# EAGLE design gate-boron (EAGLE 9.6.2)
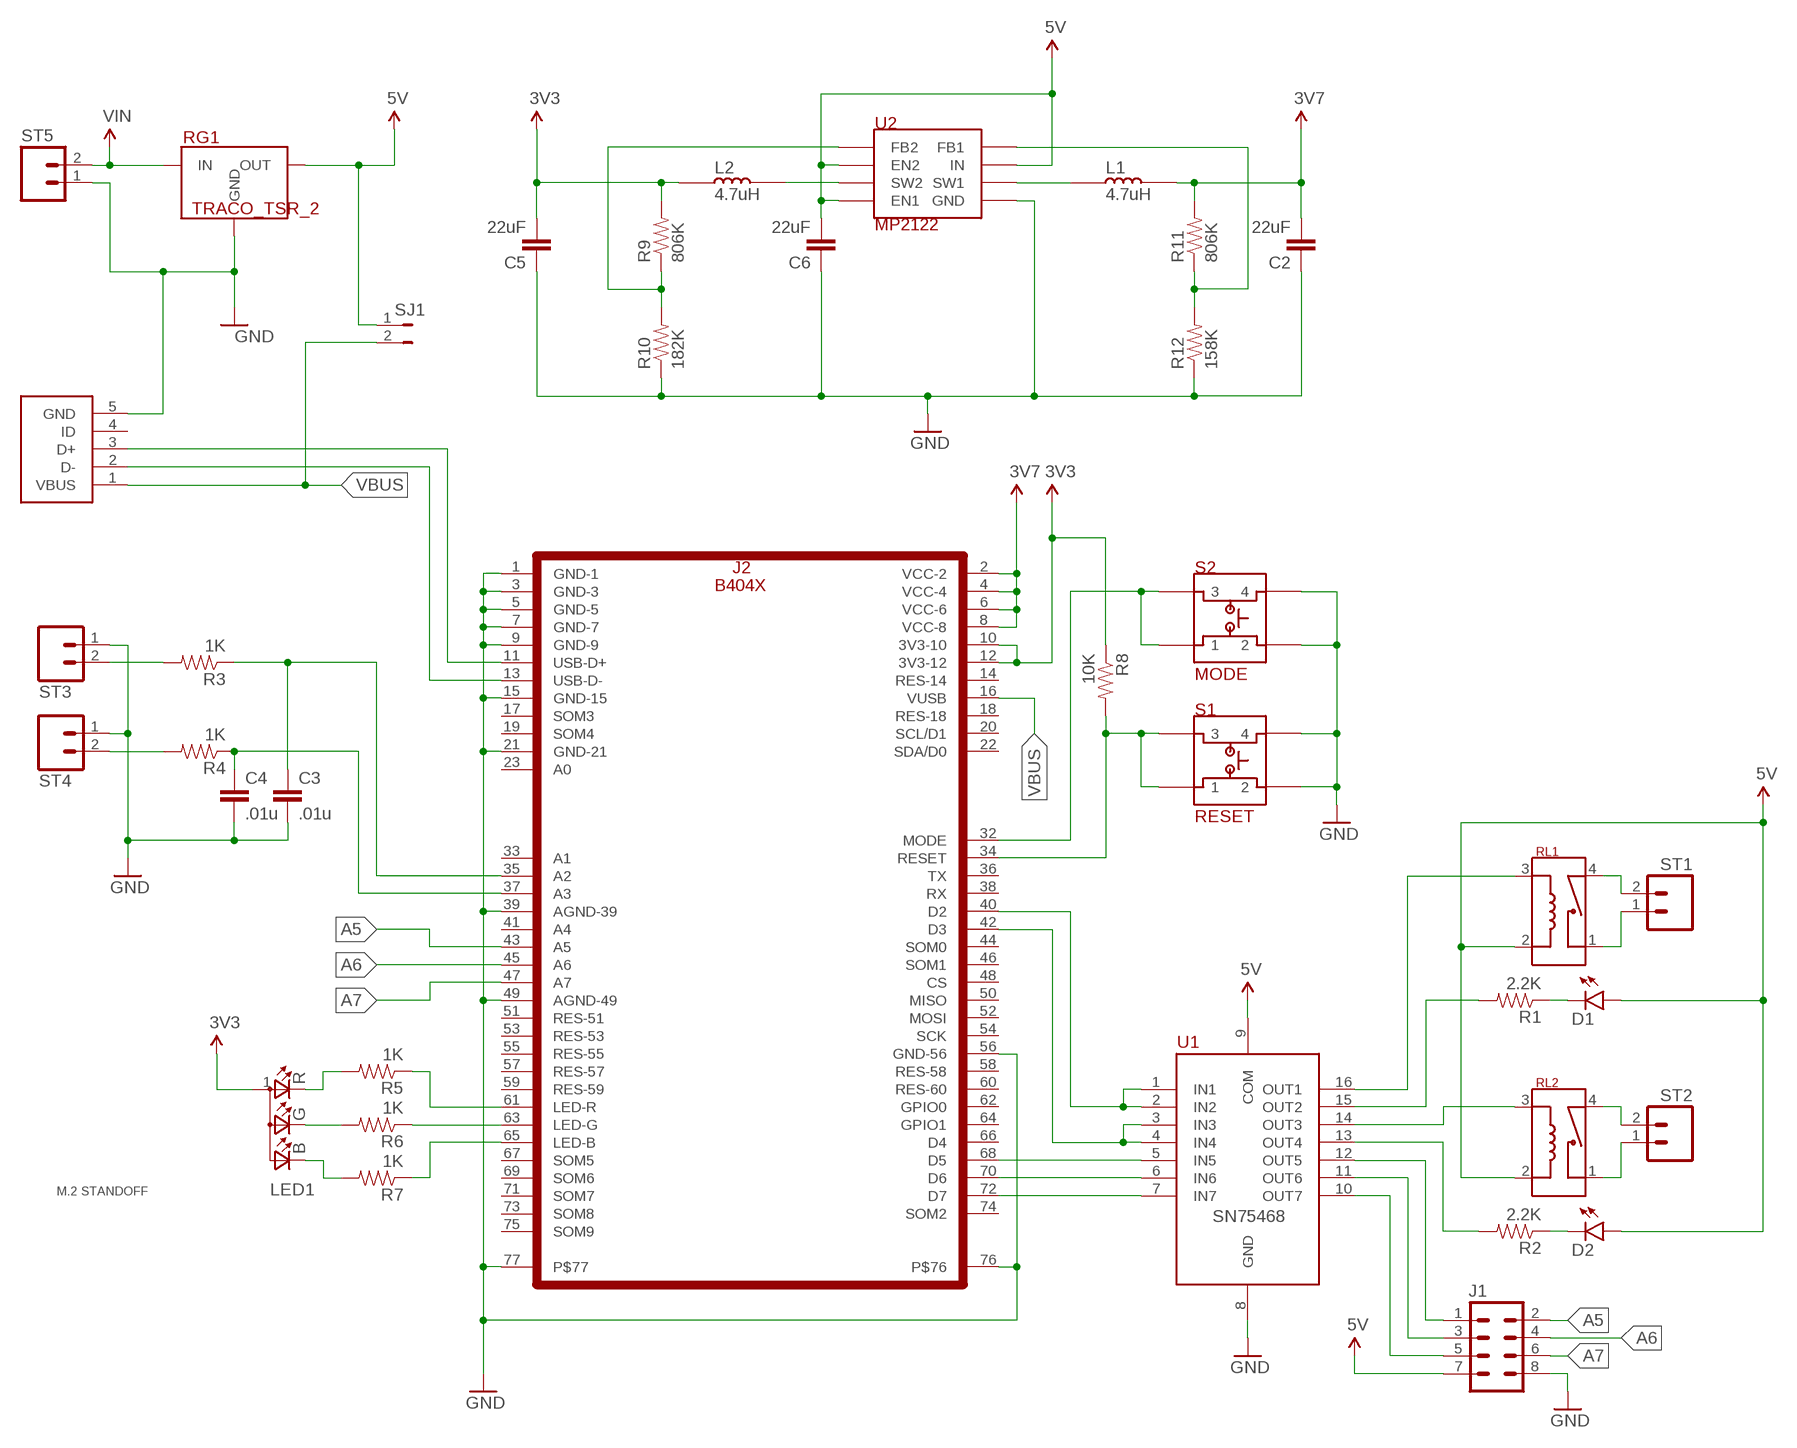
[diagram p0: schematic, sheet 1]

## Parts
C2  22uF  CAP-22UF-0805  [0805]
C3  .01u  CAP0603-CAP  [0603-CAP]
C4  .01u  CAP0603-CAP  [0603-CAP]
C5  22uF  CAP-22UF-0805  [0805]
C6  22uF  CAP-22UF-0805  [0805]
D1  LED0603  [LED-0603]
D2  LED0603  [LED-0603]
J1  M04X2  [2X4]
J2  B404X  SPARK_M.2EKEY  [SPARK_M.2EKEY-LESS-CREAM]
L1  4.7uH  INDUCTOR-4.7UH  [1008-BOURNS]
L2  4.7uH  INDUCTOR-4.7UH  [1008-BOURNS]
LED1  LED-RGB-CREE-SMD  [LED-RGB-CREE-SMD]
R1  2.2K  RESISTOR0603  [0603-RES]
R2  2.2K  RESISTOR0603  [0603-RES]
R3  1K  RESISTOR0603  [0603-RES]
R4  1K  RESISTOR0603  [0603-RES]
R5  1K  RESISTOR0603  [0603-RES]
R6  1K  RESISTOR0603  [0603-RES]
R7  1K  RESISTOR0603  [0603-RES]
R8  10K  RESISTOR0603  [0603-RES]
R9  806K  RES-806K-0603  [0603-RES]
R10  182K  RES-182K-0603  [0603-RES]
R11  806K  RES-806K-0603  [0603-RES]
R12  158K  RES-158K-0603  [0603-RES]
RG1  TRACO_TSR_2  [TRACO_TSR_2]
RL1  HE3600_RELAY  [HE3600_RELAY]
RL2  HE3600_RELAY  [HE3600_RELAY]
S1  RESET  SWITCH-MOM-4.5  [SWITCH-MOM-4.5]
S2  MODE  SWITCH-MOM-4.5  [SWITCH-MOM-4.5]
SJ1  JUMPER-PTH-2-NO  [PTH-JUMPER-2-NO_NO_SILK]
ST1  SCREWTERM_2  [SCREWTERM_0.2X2]
ST2  SCREWTERM_2  [SCREWTERM_0.2X2]
ST3  SCREWTERM_2  [SCREWTERM_0.2X2]
ST4  SCREWTERM_2  [SCREWTERM_0.2X2]
ST5  SCREWTERM_2  [SCREWTERM_0.2X2]
U1  SN75468  [SOIC16]
U2  MP2122  MPS2112  [TSOT23-8-MPS]
U$1  M2-STANDOFF  [M2-STANDOFF]
U$2  USB-MICRO-B-SOCKET-AMPHENOL  [USB-B-SMT-AMPHENOL]

## Nets
3V3: C5.2 J2.10(3V3-10) J2.12(3V3-12) L2.1 LED1.1(A) R8.1 R9.2
3V7: C2.2 J2.2(VCC-2) J2.4(VCC-4) J2.6(VCC-6) J2.8(VCC-8) L1.2 R11.2
5V: C6.2 D1.A D2.A J1.7 RG1.3(OUT) RL1.2(R1) RL2.2(R1) SJ1.1 U1.9(COM) U2.2(EN2) U2.4(EN1) U2.7(IN)
A5: J1.2 J2.43(A5)
A6: J1.4 J2.45(A6)
A7: J1.6 J2.47(A7)
GND: C2.1 C3.2 C4.2 C5.1 C6.1 J1.8 J2.1(GND-1) J2.3(GND-3) J2.5(GND-5) J2.7(GND-7) J2.9(GND-9) J2.15(GND-15) J2.21(GND-21) J2.39(AGND-39) J2.49(AGND-49) J2.56(GND-56) J2.76 J2.77 R10.1 R12.1 RG1.2(GND) S1.2 S1.4 S2.2 S2.4 ST3.1 ST4.1 ST5.1 U1.8(GND) U2.5(GND) U$2.5(GND)
L5: J1.1 U1.12(OUT5)
L6: J1.3 U1.11(OUT6)
L7: J1.5 U1.10(OUT7)
N$1: D2.C R2.1
N$2: RL1.4(C2) ST1.2
N$3: D1.C R1.1
N$4: RL2.4(C2) ST2.2
N$5: R2.2 U1.13(OUT4)
N$6: R1.2 U1.15(OUT2)
N$7: C4.1 J2.37(A3) R4.1
N$8: J2.13(USB-D-) U$2.2(D-)
N$9: RL2.1(C1) ST2.1
N$10: LED1.4(R) R5.2
N$11: LED1.3(G) R6.2
N$12: LED1.2(B) R7.2
N$13: RL1.1(C1) ST1.1
N$14: L2.2 U2.3(SW2)
N$15: J2.63(LED-G) R6.1
N$16: J2.61(LED-R) R5.1
N$17: R4.2 ST4.2
N$18: R3.2 ST3.2
N$19: J2.65(LED-B) R7.1
N$20: L1.1 U2.6(SW1)
N$21: J2.32(MODE) S2.1 S2.3
N$22: RL2.3(R2) U1.14(OUT3)
N$23: J2.34(RESET) R8.2 S1.1 S1.3
N$24: R11.1 R12.2 U2.8(FB1)
N$25: R9.1 R10.2 U2.1(FB2)
N$26: J2.40(D2) U1.1(IN1) U1.2(IN2)
N$27: J2.42(D3) U1.3(IN3) U1.4(IN4)
N$28: J2.11(USB-D+) U$2.3(D+)
N$29: J2.68(D5) U1.5(IN5)
N$30: J2.70(D6) U1.6(IN6)
N$31: C3.1 J2.35(A2) R3.1
N$32: J2.72(D7) U1.7(IN7)
N$33: RL1.3(R2) U1.16(OUT1)
VBUS: J2.16(VUSB) SJ1.2 U$2.1(VBUS)
VIN: RG1.1(IN) ST5.2
Unconnected: J2.14(RES-14) J2.17(SOM3) J2.18(RES-18) J2.19(SOM4) J2.20(SCL/D1) J2.22(SDA/D0) J2.23(A0) J2.33(A1) J2.36(TX) J2.38(RX) J2.41(A4) J2.44(SOM0) J2.46(SOM1) J2.48(CS) J2.50(MISO) J2.51(RES-51) J2.52(MOSI) J2.53(RES-53) J2.54(SCK) J2.55(RES-55) J2.57(RES-57) J2.58(RES-58) J2.59(RES-59) J2.60(RES-60) J2.62(GPIO0) J2.64(GPIO1) J2.66(D4) J2.67(SOM5) J2.69(SOM6) J2.71(SOM7) J2.73(SOM8) J2.74(SOM2) J2.75(SOM9) U$2.4(ID)

## Library data of the parts
C2 C5 C6 = SomUSB1:CAP-22UF-0805: 22 uF capacitor 6.3V 0805 $ .314 https://www.digikey.com/product-detail/en/murata-electronics-north-america/GRM219R61A226MEA0D/490-9951-1-ND/5026414
C3 C4 = SparkFun-Capacitors:CAP: Capacitor Standard 0603 ceramic capacitor, and 0.1" leaded capacitor.
D1 D2 = SparkFun-LED:LED: LEDs Standard schematic elements and footprints for 5mm, 3mm, 1206, and 0603 sized LEDs. 5mm - Spark Fun Electronics SKU : COM-00529 (and others)
J1 = SparkFun-Connectors:M04X2: .1" header, two rows of four.
J2 = SomUSB1:SPARK_M.2EKEY: $1.42 CONN FEMALE 67POS 0.020 GOLD TE Connectivity AMP Connectors 2199230-4 https://www.digikey.com/product-detail/en/te-connectivity-amp-connectors/2199230-4/A115904CT-ND/4208916
L1 L2 = SomUSB1:INDUCTOR-4.7UH: FIXED IND 4.7UH 1.1A 110 MOHM $0.26 Bourns CVH252009-4R7M 4.7µH Shielded Multilayer Inductor 1.1A 110 mOhm Max 1008 (2520 Metric) https://www.digikey.com/product-detail/en/bourns-inc/CVH252009-4R7M/CVH252009-4R7MCT-ND/3440080
LED1 = SomUSB1:LED-RGB-CREE-SMD: LED RGB DIFFUSED 4SMD $ 0.35 Cree CLMVB-FKA-CFHEHLCBB7A363 2mm 4-PLCC common anode RGB LED https://www.digikey.com/product-detail/en/cree-inc/CLMVB-FKA-CFHEHLCBB7A363/CLMVB-FKA-CFHEHLCBB7A363CT-ND/6138627 Red=68 ohm, Green/Blue=33 ohm @ 3.3V
R1-R8 = SparkFun-Resistors:RESISTOR: Resistor Basic schematic elements and footprints for 0603, 1206, and PTH resistors.
R9 R11 = SomUSB1:RES-806K-0603: Panasonic Electronic Components ERJ-3EKF8063V 806 kOhms ±1% 0.1W, 1/10W Chip Resistor 0603 (1608 Metric) Automotive AEC-Q200 Thick Film https://www.digikey.com/products/en/resistors/chip-resistor-surface-mount/52?k=&pkeyword=&sv=0&v=10&pv7=2&pv1989=0&pv2085=u806+kOhms&pv16=5&sf=1&FV=ffe00034&quantity=&ColumnSort=0&page=1&stock=1&pageSize=25
R10 = SomUSB1:RES-182K-0603: Panasonic Electronic Components ERJ-3EKF1823V 182 kOhms ±1% 0.1W, 1/10W Chip Resistor 0603 (1608 Metric) Automotive AEC-Q200 Thick Film https://www.digikey.com/product-detail/en/panasonic-electronic-components/ERJ-3EKF1823V/P182KHCT-ND/198208
R12 = SomUSB1:RES-158K-0603: Panasonic Electronic Components ERJ-3EKF1583V 158 kOhms ±1% 0.1W, 1/10W Chip Resistor 0603 (1608 Metric) Automotive AEC-Q200 Thick Film https://www.digikey.com/product-detail/en/panasonic-electronic-components/ERJ-3EKF1583V/P158KHCT-ND/198182
RG1 = Puffin:TRACO_TSR_2
RL1 RL2 = Puffin:HE3600_RELAY
S1 S2 = SomUSB1:SWITCH-MOM-4.5: Manufacturer: E-Switch Manufacturer Part Number: TL3305AF160QG Description: SWITCH TACTILE SPST-NO 50MA 12V Detailed Description: Tactile Switch SPST-NO Top Actuated Surface Mount $0.20 https://www.digikey.com/product-detail/en/e-switch/TL3305AF160QG/EG5350CT-ND/5816195
SJ1 = SomUSB1:JUMPER-PTH-2-NO
ST1-ST5 = Puffin:SCREWTERM_2
U1 = Puffin:SN75468
U2 = SomUSB1:MPS2112: Monolithic Power Systems Inc. MP2122GJ-Z $2.51 IC REG BUCK ADJ 2A DL SYNC Buck Switching Regulator IC Positive Adjustable 0.608V 2 Output 2A SOT-23-8 Thin, TSOT-23-8 https://www.digikey.com/product-detail/en/monolithic-power-systems-inc/MP2122GJ-Z/1589-1872-1-ND/5291939
U$1 = SomUSB1:M2-STANDOFF: https://www.digikey.com/product-detail/en/jae-electronics/SM3ZS067U310-NUT1-R1800/670-2864-1-ND/5955848
U$2 = SomUSB1:USB-MICRO-B-SOCKET-AMPHENOL: CONN USB MICRO B RECPT SMT R/A $0.42 Amphenol FCI 10118194-0001LF https://www.digikey.com/products/en?keywords=609-4618-1-nd

## Board
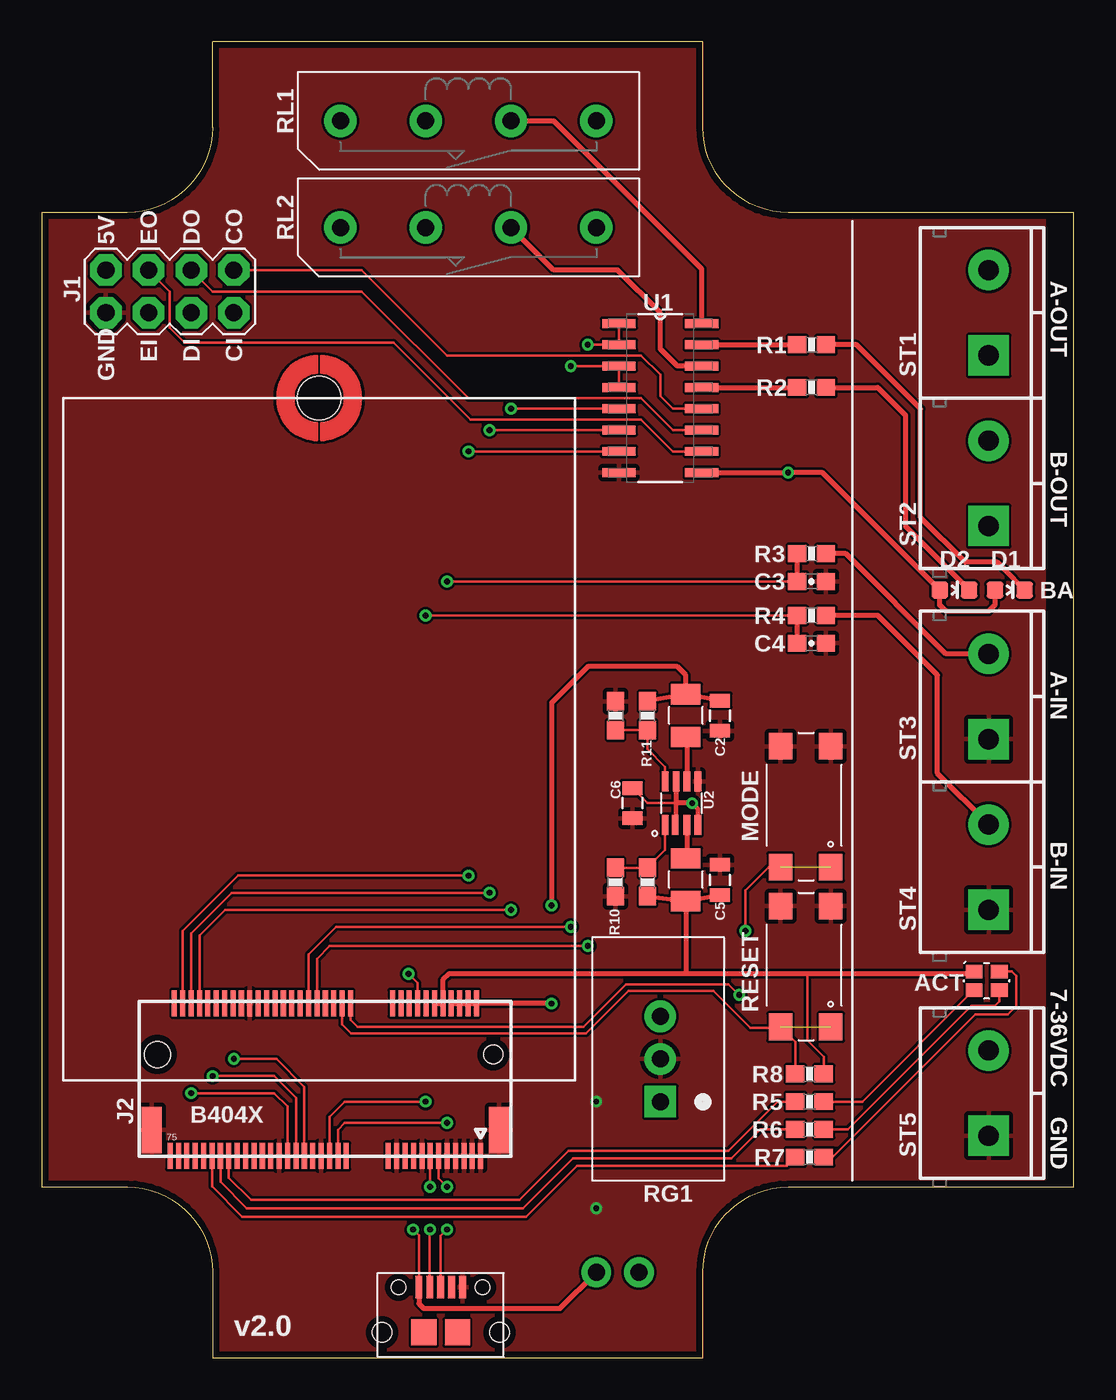
[diagram p1: board, top side]
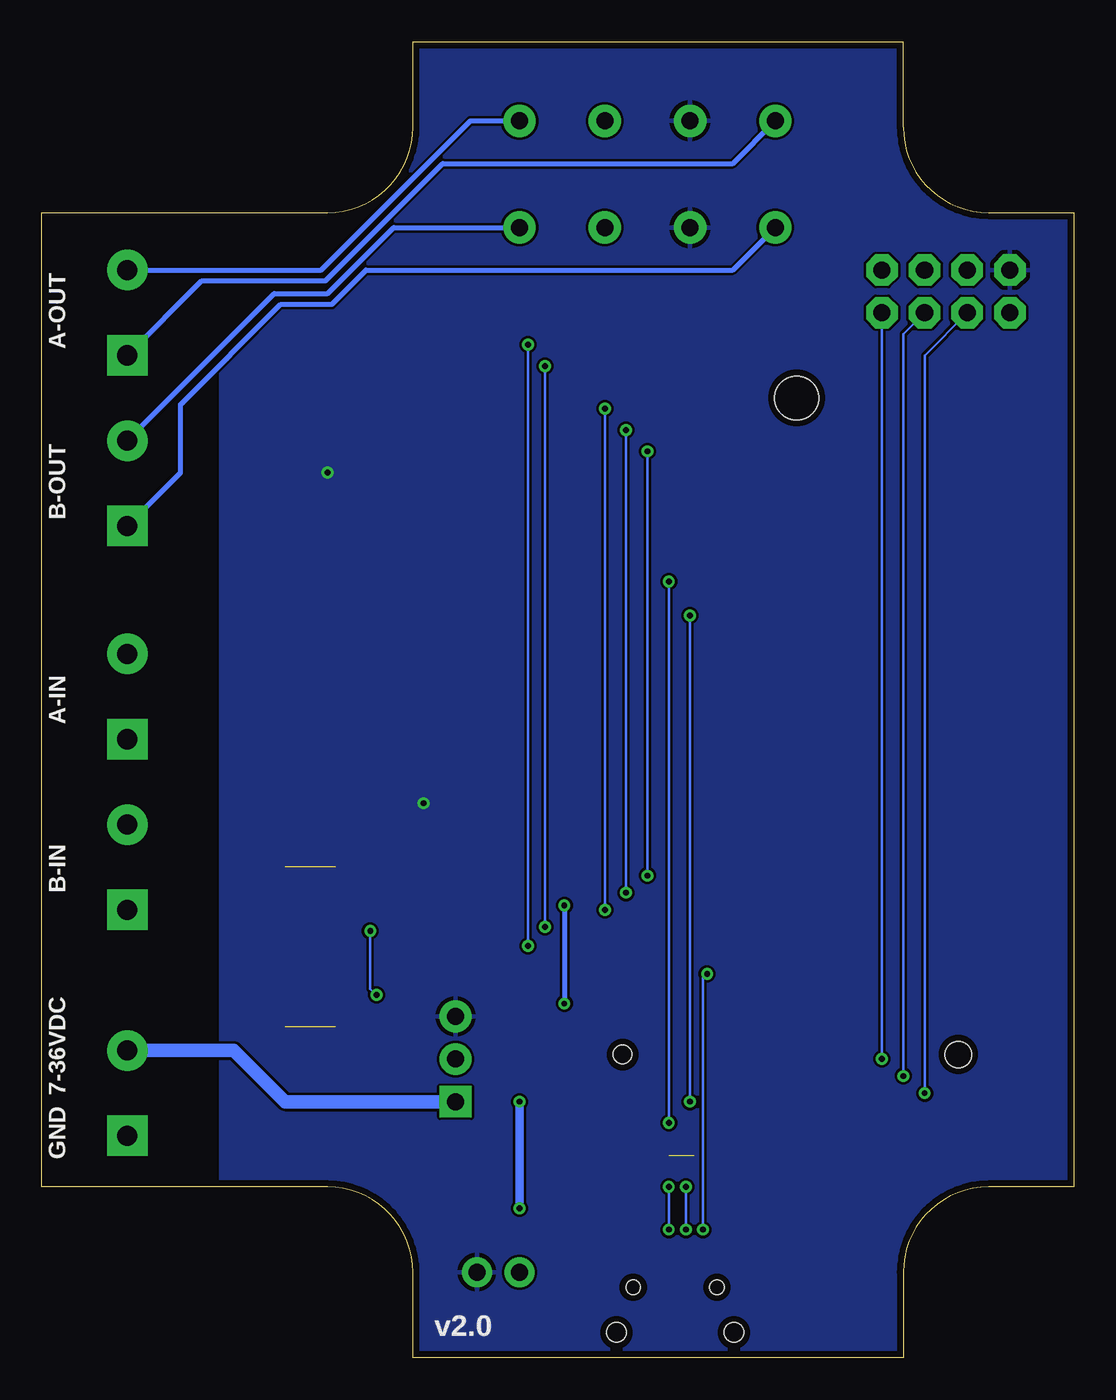
[diagram p2: board, bottom side, seen from below]

Size 61.47 x 78.36 mm. Coordinates in mm from the lower left corner, seen from the top.
Outline: 39.37,73.28 39.37,78.36 10.16,78.36 10.16,73.28 arc-90 5.08,68.2 0,68.2 0,10.16 5.08,10.16 arc-90 10.16,5.08 10.16,0 39.37,0 39.37,5.08 arc-90 44.45,10.16 61.47,10.16 61.47,68.2 44.45,68.2
Outline: 44.45,68.2 arc-90 39.37,73.28
Outline: 44.45,68.2 arc-90 39.37,73.28
Copper layers (1*16): Top 0.0356mm / dielectric 1.5011mm / Bottom 0.0356mm
Design rules "oshpark-2layer": minimum track width 6mil, minimum drill 13mil, track to track 6mil, track to pad 6mil, pad to pad 6mil, via to via 6mil, smd to smd 6mil, copper to edge 15mil, drill to drill 6mil, minimum pad ring 7mil, minimum via ring 7mil, stop-mask expansion 2.5mil, vias tented up to drill 0mil, thermal gap 10mil

### Footprints (pad centres in the part's own frame; a part is rotated, then mirrored left to right if it is on the bottom)
0805 = smd 0.8 x 1.2: 1 -0.9,0; 2 0.9,0
0603-CAP = smd 1.1 x 1: 1 -0.85,0; 2 0.85,0
LED-0603 = smd 1 x 1: A 0,-0.877; C 0,0.877
2X4 = drill 1.016 pad 1.88 octagon: 1 -3.81,-1.27; 2 -3.81,1.27; 3 -1.27,-1.27; 4 -1.27,1.27; 5 1.27,-1.27; 6 1.27,1.27; 7 3.81,-1.27; 8 3.81,1.27
SPARK_M.2EKEY-LESS-CREAM = smd 0.3 x 1.55: 1 -9.62,4.51; 2 -9.37,-4.59; 3 -9.12,4.51; 4 -8.87,-4.59; 5 -8.62,4.51; 6 -8.37,-4.59; 7 -8.12,4.51; 8 -7.87,-4.59; 9 -7.62,4.51; 10 -7.37,-4.59; 11 -7.12,4.51; 12 -6.87,-4.59; 13 -6.62,4.51; 14 -6.37,-4.59; 15 -6.12,4.51; 16 -5.87,-4.59; 17 -5.62,4.51; 18 -5.37,-4.59; 19 -5.12,4.51; 20 -4.87,-4.59; 21 -4.62,4.51; 22 -4.37,-4.59; 23 -4.12,4.51; 32 -1.87,-4.59; 33 -1.62,4.51; 34 -1.37,-4.59; 35 -1.12,4.51; 36 -0.87,-4.59; 37 -0.62,4.51; 38 -0.37,-4.59; 39 -0.12,4.51; 40 0.13,-4.59; 41 0.38,4.51; 42 0.63,-4.59; 43 0.88,4.51; 44 1.13,-4.59; 45 1.38,4.51; 46 1.63,-4.59; 47 1.88,4.51; 48 2.13,-4.59; 49 2.38,4.51; 50 2.63,-4.59; 51 2.88,4.51; 52 3.13,-4.59; 53 3.38,4.51; 54 3.63,-4.59; 55 3.88,4.51; 56 4.13,-4.59; 57 4.38,4.51; 58 4.63,-4.59; 59 4.88,4.51; 60 5.13,-4.59; 61 5.38,4.51; 62 5.63,-4.59; 63 5.88,4.51; 64 6.13,-4.59; 65 6.38,4.51; 66 6.63,-4.59; 67 6.88,4.51; 68 7.13,-4.59; 69 7.38,4.51; 70 7.63,-4.59; 71 7.88,4.51; 72 8.13,-4.59; 73 8.38,4.51; 74 8.63,-4.59; 75 8.88,4.51 | smd 1.2 x 2.75: 76 9.98,2.96; 77 -10.72,2.96 | hole 1.1: -10.37,-1.54 | hole 1.55: 9.63,-1.54
1008-BOURNS = smd 1.2 x 1.75: 1 0,0; 2 2.55,0
LED-RGB-CREE-SMD = smd 1 x 0.8: 1 1.5,0; 2 0,0; 3 0,1.1; 4 1.5,1.1
0603-RES = smd 1.1 x 1: 1 -0.85,0; 2 0.85,0
TRACO_TSR_2 = drill 1.016 pad 1.88 square: 1 -2.54,0 | drill 1.016 pad 1.88: 2 0,0; 3 2.54,0
HE3600_RELAY = drill 1.016 pad 1.93: 1 0,0; 2 0,-5.08; 3 0,-10.16; 4 0,-15.24
SWITCH-MOM-4.5 = smd 1.6 x 1.4: 1 0,0; 2 7.2,0; 3 0,3; 4 7.2,3
PTH-JUMPER-2-NO_NO_SILK = drill 1.016 pad 1.778: 1 -1.27,0; 2 1.27,0
SCREWTERM_0.2X2 = drill 1.2 pad 2.413 square: 1 0,0 | drill 1.2 pad 2.413: 2 5.08,0
SOIC16 = smd 1.981 x 0.533: 1 -2.464,4.445; 2 -2.464,3.175; 3 -2.464,1.905; 4 -2.464,0.635; 5 -2.464,-0.635; 6 -2.464,-1.905; 7 -2.464,-3.175; 8 -2.464,-4.445; 9 2.464,-4.445; 10 2.464,-3.175; 11 2.464,-1.905; 12 2.464,-0.635; 13 2.464,0.635; 14 2.464,1.905; 15 2.464,3.175; 16 2.464,4.445
TSOT23-8-MPS = smd 0.4 x 1.2: 1 -0.975,-1.3; 2 -0.375,-1.3; 3 0.325,-1.3; 4 0.975,-1.3; 5 0.975,1.3; 6 0.325,1.3; 7 -0.325,1.3; 8 -0.975,1.3
M2-STANDOFF = hole 2.6: 0,0
USB-B-SMT-AMPHENOL = smd 0.4 x 1.35: 1 -1.3,0; 2 -0.65,0; 3 0,0; 4 0.65,0; 5 1.3,0 | smd 1.5 x 1.55: P$6 -1,-2.7; P$7 1,-2.7 | hole 0.85: -2.5,0; 2.5,0 | hole 1.15: -3.5,-2.7; 3.5,-2.7

### Placement (x,y rotation side)
C2  40.39,38.23 90 top
C3  45.85,46.23 0 top
C4  45.85,42.55 0 top
C5  40.39,28.45 270 top
C6  35.18,33.02 90 top
D1  57.66,45.72 270 top
D2  54.36,45.72 270 top
J1  7.62,63.5 180 top
J2  16.51,16.51 180 top
L1  38.35,36.96 90 top
L2  38.35,27.18 90 top
LED1  57.02,22.99 180 top
R1  45.85,60.33 180 top
R2  45.85,57.78 180 top
R3  45.85,47.88 0 top
R4  45.85,44.2 0 top
R5  45.72,15.24 0 top
R6  45.72,13.59 0 top
R7  45.72,11.94 0 top
R8  45.72,16.89 180 top
R9  36.07,28.32 270 top
R10  34.16,28.32 90 top
R11  36.07,38.23 90 top
R12  34.16,38.23 270 top
RG1  36.83,17.78 90 top
RL1  17.78,73.66 90 top
RL2  17.78,67.31 90 top
S1  46.99,19.68 90 top
S2  46.99,29.21 90 top
SJ1  34.29,5.08 180 top
ST1  56.39,59.69 90 top
ST2  56.39,49.53 90 top
ST3  56.39,36.83 90 top
ST4  56.39,26.67 90 top
ST5  56.39,13.21 90 top
U1  36.83,57.15 0 top
U2  38.1,33.02 0 top
U$1  16.51,57.15 0 top
U$2  23.75,4.19 0 top

### Tracks (layer width: path | path; a pad name or v marks a point on that pad's centre or on a via)
3V3
  Top 0.152: R8.1 46.57,17.91 45.59,18.88 45.59,22.86
  Top 0.254: C5.2 L2.1 R9.2
  Top 0.305: J2.12 J2.10 23.88,22.48 24.26,22.86 38.35,22.86 | L2.1 38.35,22.86 | 38.35,22.86 45.59,22.86 55.4,22.86 LED1.1
3V7  (via drill 0.35)
  Top 0.254: C2.2 L1.2 36.19,39.12 R11.2 | J2.2 25.9,21.08
  Top 0.305: L1.2 38.35,40.64 37.85,41.15 32.51,41.15 30.35,38.99 v30.35,26.92 | v30.35,21.08 25.9,21.08 | J2.8 J2.6 J2.4 J2.2
  Bottom 0.305: v30.35,26.92 v30.35,21.08
5V  (via drill 0.35)
  Top 0.152: 37.77,31.77 U2.2 | C6.2 36.08,33.02 37.77,33.02
  Top 0.254: 37.77,33.02 37.77,31.77 | U2.4 39.08,32.68 v38.73,33.02
  Top 0.305: D1.A 56.78,44.84 56.39,44.45 53.85,44.45 53.48,44.82 D2.A 46.49,52.7 v44.45,52.7 U1.9 | U2.7 37.77,33.02 v38.73,33.02
  pour Bottom: -1.27,80.01 -1.27,-1.27 50.8,-1.27 50.8,80.01
A5  (via drill 0.35)
  Top 0.152: v11.43,17.78 13.97,17.78 15.63,16.12 J2.43
  Bottom 0.152: J1.2 v11.43,17.78
A6  (via drill 0.35)
  Top 0.152: v10.16,16.76 13.84,16.76 15.13,15.48 J2.45
  Bottom 0.152: J1.4 10.16,60.96 v10.16,16.76
A7  (via drill 0.35)
  Top 0.152: v8.89,15.75 13.84,15.75 14.63,14.96 J2.47
  Bottom 0.152: J1.6 8.89,59.69 v8.89,15.75
GND  (via drill 0.35)  (1 unrouted)
  Bottom 0.508: v33.02,15.24 v33.02,8.89
  pour Top: 0,81.28 0,-1.27 59.69,-1.27 59.69,81.28
L5
  Top 0.152: U1.12 37.59,56.52 36.83,57.28 36.83,58.55 35.69,59.69 24.13,59.69 19.05,64.77 J1.1
L6
  Top 0.152: J1.3 10.16,63.5 19.05,63.5 25.4,57.15 35.69,57.15 37.59,55.24 U1.11
L7
  Top 0.152: U1.10 37.59,53.98 35.69,55.88 25.53,55.88 20.95,60.45 8.51,60.45 7.62,61.34 7.62,63.5 J1.5
N$1
  Top 0.305: R2.1 49.78,57.78 51.44,56.13 51.44,49.52 D2.C
N$2
  Bottom 0.305: ST1.2 44.83,64.77 35.94,73.66 RL1.4
N$3
  Top 0.305: D1.C 57.29,46.99 56.91,47.37 54.99,47.37 52.32,50.04 52.32,56.52 48.51,60.33 R1.1
N$4
  Bottom 0.305: ST2.2 47.62,63.37 44.45,63.37 40.51,67.31 RL2.4
N$5
  Top 0.305: U1.13 R2.2
N$6
  Top 0.305: U1.15 R1.2
N$7  (via drill 0.35)
  Top 0.152: R4.1 v22.86,44.2 | v22.86,15.24 18.03,15.24 17.13,14.34 J2.37
  Top 0.305: C4.1 R4.1
  Bottom 0.152: v22.86,44.2 v22.86,15.24
N$8  (via drill 0.35)
  Top 0.152: J2.13 23.13,10.18 v23.11,10.16 | v23.11,7.62 23.1,7.61 U$2.2
  Bottom 0.152: v23.11,10.16 v23.11,7.62
N$9
  Bottom 0.305: ST2.1 53.21,52.7 53.21,56.77 47.24,62.74 44.2,62.74 42.16,64.77 20.32,64.77 RL2.1
N$10
  Top 0.152: LED1.4 48.88,15.24 R5.2
N$11
  Top 0.152: LED1.3 57.02,21.21 56.77,20.95 55.37,20.95 48.01,13.59 R6.2
N$12
  Top 0.152: LED1.2 57.78,22.99 58.04,22.73 58.04,20.95 57.53,20.45 55.59,20.45 47.08,11.94 R7.2
N$13
  Bottom 0.305: ST1.1 51.94,64.14 44.58,64.14 37.59,71.12 20.32,71.12 RL1.1
N$14
  Top 0.305: U2.3 38.42,29.8 L2.2
N$15
  Top 0.152: R6.1 42.8,13.59 41.07,11.86 31.62,11.86 28.65,8.89 12.19,8.89 10.63,10.45 J2.63
N$16
  Top 0.152: J2.61 11.13,10.71 12.45,9.4 28.45,9.4 31.37,12.32 40.89,12.32 43.81,15.24 R5.1
N$17
  Top 0.305: ST4.2 53.34,34.8 53.34,40.64 49.78,44.2 R4.2
N$18
  Top 0.305: ST3.2 53.85,41.91 47.88,47.88 R3.2
N$19
  Top 0.152: J2.65 10.13,10.19 11.94,8.38 28.83,8.38 31.88,11.43 44.36,11.43 R7.1
N$20
  Top 0.254: L1.1 38.42,36.89
  Top 0.305: 38.42,36.89 U2.6
N$21  (via drill 0.35)  (1 unrouted)
  Top 0.152: J2.32 18.38,20.1 18.8,19.68 32.26,19.68 34.8,22.23 40.89,22.23 v41.53,21.59 | S2.3 43.31,29.21 41.91,27.81 v41.91,25.4
  Bottom 0.152: v41.91,25.4 41.91,21.97 v41.53,21.59
N$22
  Top 0.305: U1.14 37.85,59.05 36.83,60.07 36.83,62.23 34.29,64.77 30.48,64.77 RL2.3
N$23  (1 unrouted)
  Top 0.152: J2.34 17.88,19.84 18.41,19.31 32.39,19.31 34.92,21.84 40.01,21.84 42.2,19.64 44.03,19.64 | S1.3 44.03,19.64 | 44.03,19.64 44.87,18.8 R8.2
N$24
  Top 0.152: U2.8 37.12,35.18 36.07,36.23 R11.1 R12.2
N$25
  Top 0.152: R10.2 R9.1 37.12,30.23 U2.1
N$26  (via drill 0.35)
  Top 0.152: U1.1 U1.2 v32.51,60.33 | J2.40 16.38,23.75 17.14,24.51 v32.51,24.51
  Bottom 0.152: v32.51,60.33 v32.51,24.51
N$27  (via drill 0.35)
  Top 0.152: v31.5,59.05 U1.3 U1.4 | v31.5,25.65 17.53,25.65 15.88,24 J2.42
  Bottom 0.152: v31.5,59.05 v31.5,25.65
N$28  (via drill 0.35)
  Top 0.152: J2.11 23.63,10.66 v24.13,10.16 | v24.13,7.62 23.75,7.24 U$2.3
  Bottom 0.152: v24.13,10.16 v24.13,7.62
N$29  (via drill 0.35)
  Top 0.152: U1.5 v27.94,56.52 | v27.94,26.67 10.92,26.67 9.38,25.13 J2.68
  Bottom 0.152: v27.94,56.52 v27.94,26.67
N$30  (via drill 0.35)
  Top 0.152: U1.6 v26.67,55.24 | v26.67,27.69 11.3,27.69 8.88,25.26 J2.70
  Bottom 0.152: v26.67,55.24 v26.67,27.69
N$31  (via drill 0.35)
  Top 0.152: C3.1 v24.13,46.23 | J2.35 17.63,13.57 18.03,13.97 v24.13,13.97
  Top 0.305: C3.1 R3.1
  Bottom 0.152: v24.13,46.23 v24.13,13.97
N$32  (via drill 0.35)
  Top 0.152: U1.7 v25.4,53.98 | v25.4,28.7 11.68,28.7 8.38,25.4 J2.72
  Bottom 0.152: v25.4,53.98 v25.4,28.7
N$33
  Top 0.305: 39.37,61.67 U1.16 39.29,64.85 30.48,73.66 RL1.3
VBUS  (via drill 0.35)
  Top 0.152: J2.16 22.38,22.32 v21.84,22.86 | v22.1,7.62 22.45,7.27 U$2.1
  Top 0.305: U$2.1 22.45,3.21 22.73,2.92 30.86,2.92 SJ1.2
  Bottom 0.152: v21.84,22.86 22.1,22.61 v22.1,7.62
VIN
  Bottom 0.813: ST5.2 50.04,18.29 46.99,15.24 RG1.1

### Text on the board
tPlace: A-OUT | B-OUT | BA | A-IN | MODE | B-IN | ACT | 7-36VDC | RESET | GND | v2.0
bPlace: A-OUT | B-OUT | A-IN | B-IN | 7-36VDC | GND | v2.0
tNames: 5V | EO | DO | CO | EI | DI | CI | GND